# EAGLE design digital (EAGLE 7.4.0)
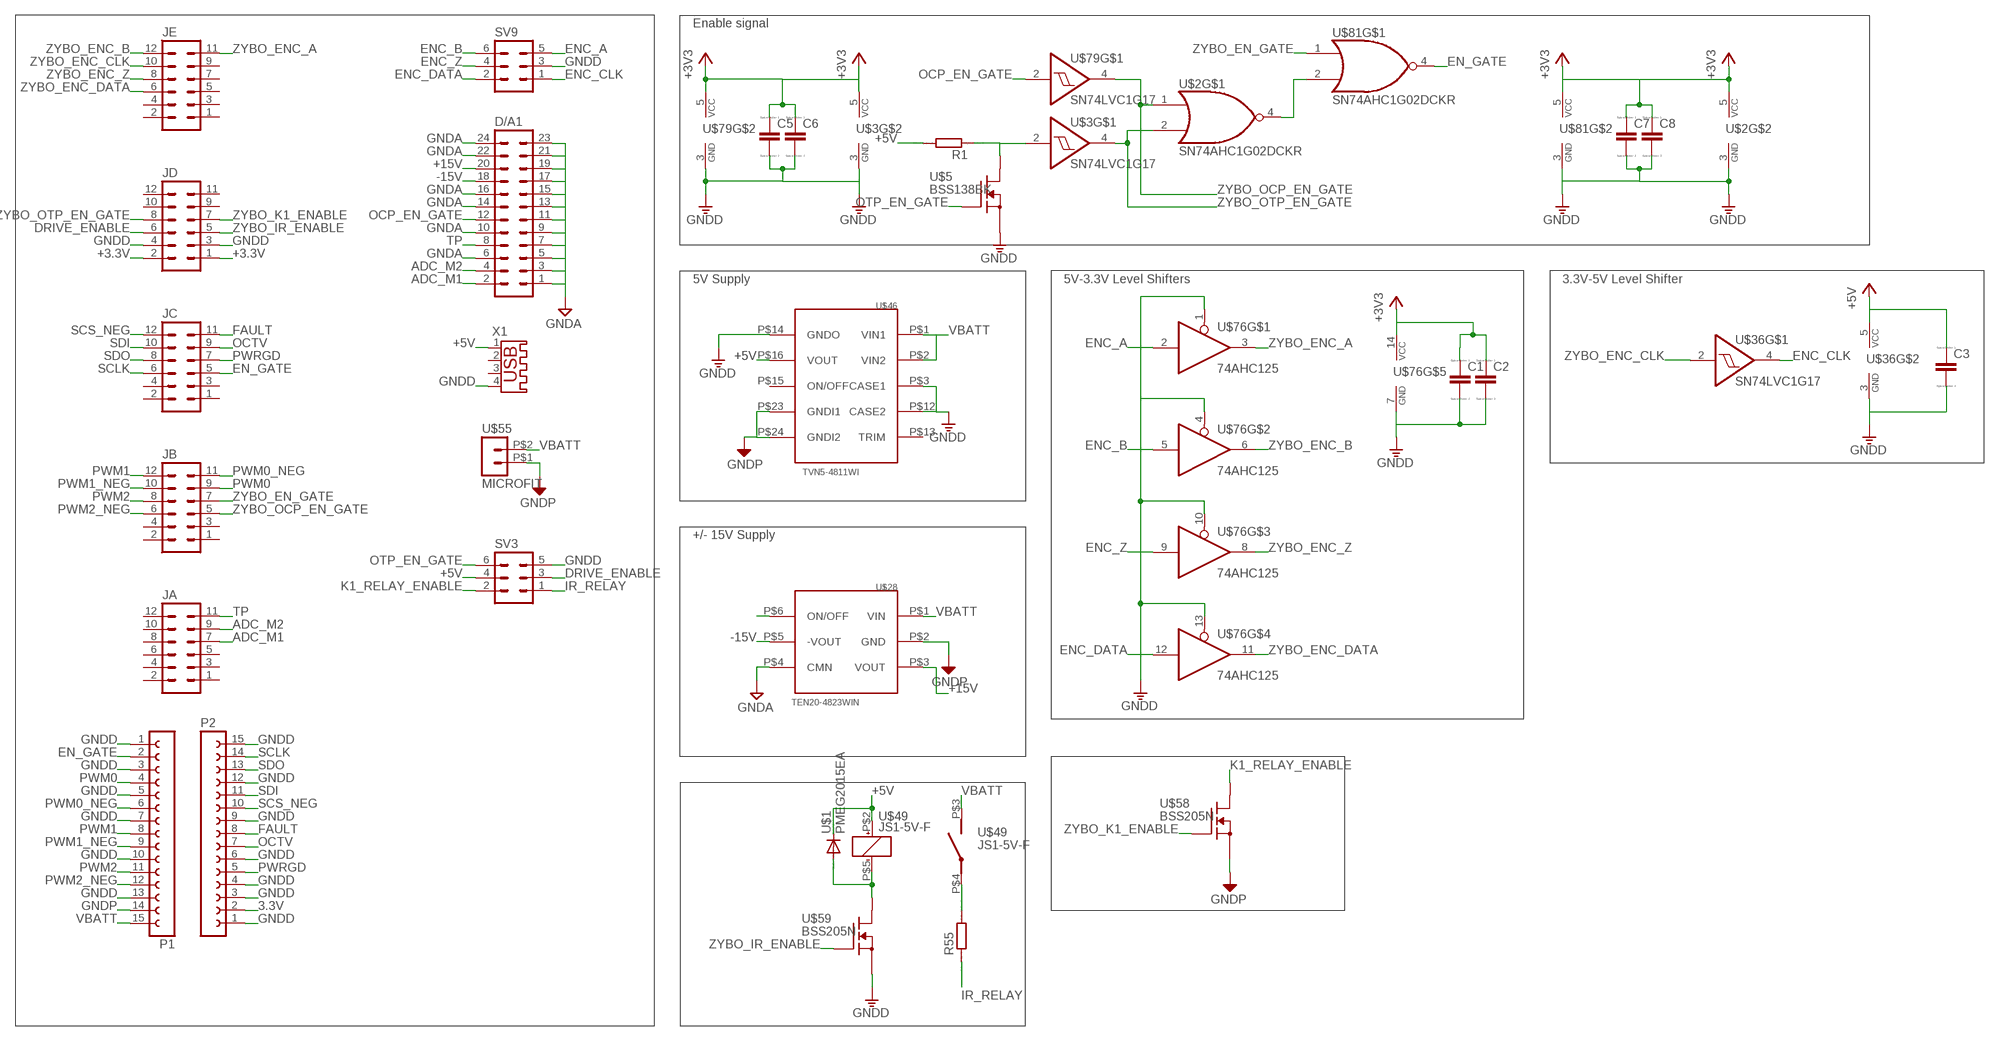
[diagram p0: schematic, sheet 1]

## Parts
C1  CC1206  [C1206]
C2  CC1206  [C1206]
C3  CC1206  [C1206]
C5  CC1206  [C1206]
C6  CC1206  [C1206]
C7  CC1206  [C1206]
C8  CC1206  [C1206]
D/A1  MA12-2  [MA12-2]
JA  MA06-2  [MA06-2]
JB  MA06-2  [MA06-2]
JC  MA06-2  [MA06-2]
JD  MA06-2  [MA06-2]
JE  MA06-2  [MA06-2]
P1  FE15-1  [FE15]
P2  FE15-1  [FE15]
R1  RR1206  [R1206]
R55  RR1206  [R1206]
SV3  MA03-2  [MA03-2]
SV9  MA03-2  [MA03-2]
U$1  PMEG2015EA  [SOD323_ST]
U$2  SN74AHC1G02DCKR  [SOT23-5]
U$3  SN74LVC1G17  [SOT23-5L]
U$5  BSS138BK  [SOT23]
U$28  TEN20-4823WIN  [TEN20-4823]
U$36  SN74LVC1G17  [SOT23-5L]
U$46  TVN5-4811WI  [DIP24]
U$49  JS1-5V-F  [JS1-5V-F]
U$55  MICROFIT  [MICROFIT-3.0]
U$58  BSS205N  [SOT23]
U$59  BSS205N  [SOT23]
U$76  74AHC125  [SO14]
U$79  SN74LVC1G17  [SOT23-5L]
U$81  SN74AHC1G02DCKR  [SOT23-5]
X1  USB-A003  [USB-A003]

## Nets
3.3V: P2.2
+3.3V: JD.1 JD.2
+3V3: C1.1 C2.1 C5.1 C6.1 C7.1 C8.1 U$2.5(VCC) U$3.5(VCC) U$76.14(VCC) U$79.5(VCC) U$81.5(VCC)
+5V: C3.1 R1.2 SV3.4 U$1.C U$36.5(VCC) U$46.P$16(VOUT) U$49.P$2(+) X1.1
+15V: D/A1.20 U$28.P$3(VOUT)
-15V: D/A1.18 U$28.P$5(-VOUT)
ADC_M1: D/A1.2 JA.7
ADC_M2: D/A1.4 JA.9
DRIVE_ENABLE: JD.6 SV3.3
EN_GATE: JC.5 P1.2 U$81.4(O)
ENC_A: SV9.5 U$76.2(I)
ENC_B: SV9.6 U$76.5(I)
ENC_CLK: SV9.1 U$36.4(O)
ENC_DATA: SV9.2 U$76.12(I)
ENC_Z: SV9.4 U$76.9(I)
FAULT: JC.11 P2.8
GNDA: D/A1.1 D/A1.3 D/A1.5 D/A1.6 D/A1.7 D/A1.9 D/A1.10 D/A1.11 D/A1.13 D/A1.14 D/A1.15 D/A1.16 D/A1.22 D/A1.23 D/A1.24 U$28.P$4(CMN)
GNDD: C1.2 C2.2 C3.2 C5.2 C6.2 C7.2 C8.2 JD.3 JD.4 P1.1 P1.3 P1.5 P1.7 P1.10 P1.13 P2.1 P2.3 P2.4 P2.6 P2.9 P2.12 P2.15 SV3.5 SV9.3 U$2.3(GND) U$3.3(GND) U$5.2(S) U$36.3(GND) U$46.P$3(CASE1) U$46.P$12(CASE2) U$46.P$14(GNDO) U$59.2(S) U$76.1(OE) U$76.4(OE) U$76.7(GND) U$76.10(OE) U$76.13(OE) U$79.3(GND) U$81.3(GND) X1.4
GNDP: P1.14 U$28.P$2(GND) U$46.P$23(GNDI1) U$46.P$24(GNDI2) U$55.P$1 U$58.2(S)
IR_RELAY: R55.1 SV3.1
K1_RELAY_ENABLE: SV3.2 U$58.3(D)
N$1: R1.1 U$3.2(I) U$5.3(D)
N$5: U$2.4(O) U$81.2(I1)
N$42: U$28.P$6(ON/OFF)
N$46: R55.2 U$49.P$4(P)
N$66: U$1.A U$49.P$5(-) U$59.3(D)
N$80: D/A1.21
N$81: D/A1.19
N$82: D/A1.17
OCP_EN_GATE: D/A1.12 U$79.2(I)
OCTV: JC.9 P2.7
OTP_EN_GATE: SV3.6 U$5.1(G)
PWM0: JB.9 P1.4
PWM0_NEG: JB.11 P1.6
PWM1: JB.12 P1.8
PWM1_NEG: JB.10 P1.9
PWM2: JB.8 P1.11
PWM2_NEG: JB.6 P1.12
PWRGD: JC.7 P2.5
SCLK: JC.6 P2.14
SCS_NEG: JC.12 P2.10
SDI: JC.10 P2.11
SDO: JC.8 P2.13
TP: D/A1.8 JA.11
VBATT: P1.15 U$28.P$1(VIN) U$46.P$1(VIN1) U$46.P$2(VIN2) U$49.P$3(S) U$55.P$2
ZYBO_EN_GATE: JB.7 U$81.1(I0)
ZYBO_ENC_A: JE.11 U$76.3(O)
ZYBO_ENC_B: JE.12 U$76.6(O)
ZYBO_ENC_CLK: JE.10 U$36.2(I)
ZYBO_ENC_DATA: JE.6 U$76.11(O)
ZYBO_ENC_Z: JE.8 U$76.8(O)
ZYBO_IR_ENABLE: JD.5 U$59.1(G)
ZYBO_K1_ENABLE: JD.7 U$58.1(G)
ZYBO_OCP_EN_GATE: JB.5 U$2.1(I0) U$79.4(O)
ZYBO_OTP_EN_GATE: JD.8 U$2.2(I1) U$3.4(O)
Unconnected: JA.1 JA.2 JA.3 JA.4 JA.5 JA.6 JA.8 JA.10 JA.12 JB.1 JB.2 JB.3 JB.4 JC.1 JC.2 JC.3 JC.4 JD.9 JD.10 JD.11 JD.12 JE.1 JE.2 JE.3 JE.4 JE.5 JE.7 JE.9 U$46.P$13(TRIM) U$46.P$15(ON/OFF) X1.2 X1.3

## Notes on the sheet
- Enable signal
- 5V Supply | 5V-3.3V Level Shifters | 3.3V-5V Level Shifter
- +/- 15V Supply

## Library data of the parts
C1-C3 C5-C8 = eagle-ltspice:C: CAPACITOR, European symbol; SPICEMODEL: NONE; SPICEPREFIX: C
D/A1 = con-lstb:MA12-2: PIN HEADER; OC_FARNELL: unknown; OC_NEWARK: unknown
JA JB JC JD JE = con-lstb:MA06-2: PIN HEADER; OC_FARNELL: unknown; OC_NEWARK: unknown
P1 P2 = con-lsta:FE15-1: FEMALE HEADER; OC_FARNELL: unknown; OC_NEWARK: unknown
R1 R55 = eagle-ltspice:R: RESISTOR, European symbol; SPICEMODEL: NONE; SPICEPREFIX: R
SV3 SV9 = con-lstb:MA03-2: PIN HEADER; OC_FARNELL: unknown; OC_NEWARK: unknown
U$1 = custom_parts:PMEG2015EA
U$2 U$81 = custom_parts:SN74AHC1G02DCKR
U$3 U$36 U$79 = custom_parts:SN74LVC1G17
U$5 = custom_parts:BSS138BK
U$28 = custom_parts:TEN20-4823WIN
U$46 = custom_parts:TVN5-4811WI
U$49 = custom_parts:JS1-5V-F
U$55 = custom_parts:MICROFIT
U$58 U$59 = custom_parts:BSS205N
U$76 = custom_parts:74AHC125
X1 = con-yamaichi:USB-A003: USB connector; OC_FARNELL: unknown; OC_NEWARK: unknown

## Board
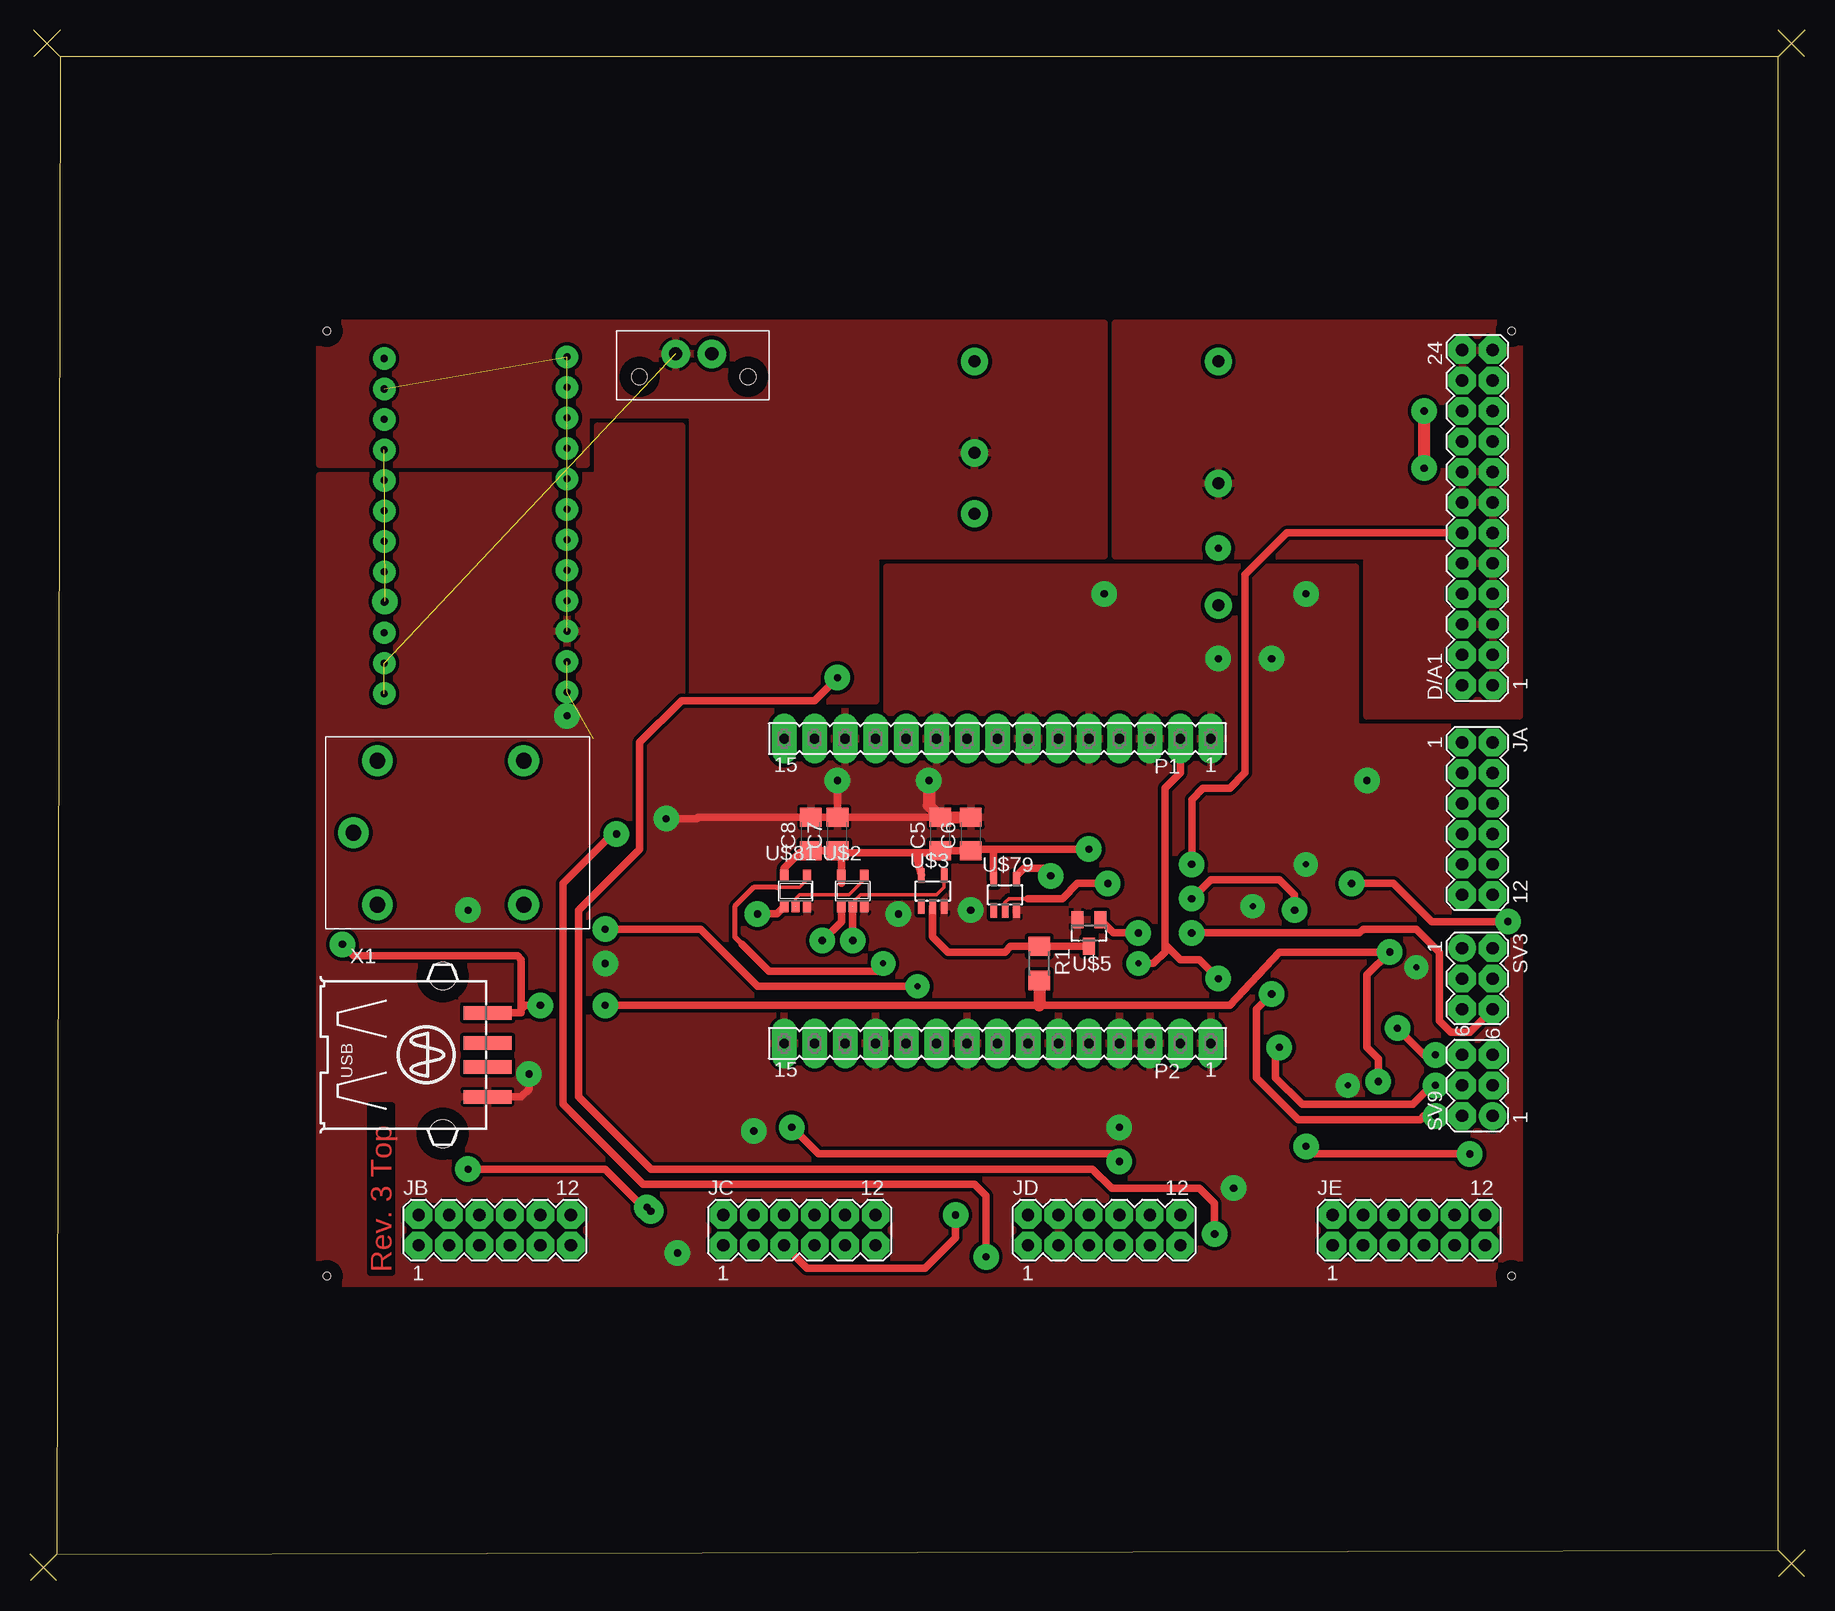
[diagram p1: board, top side]
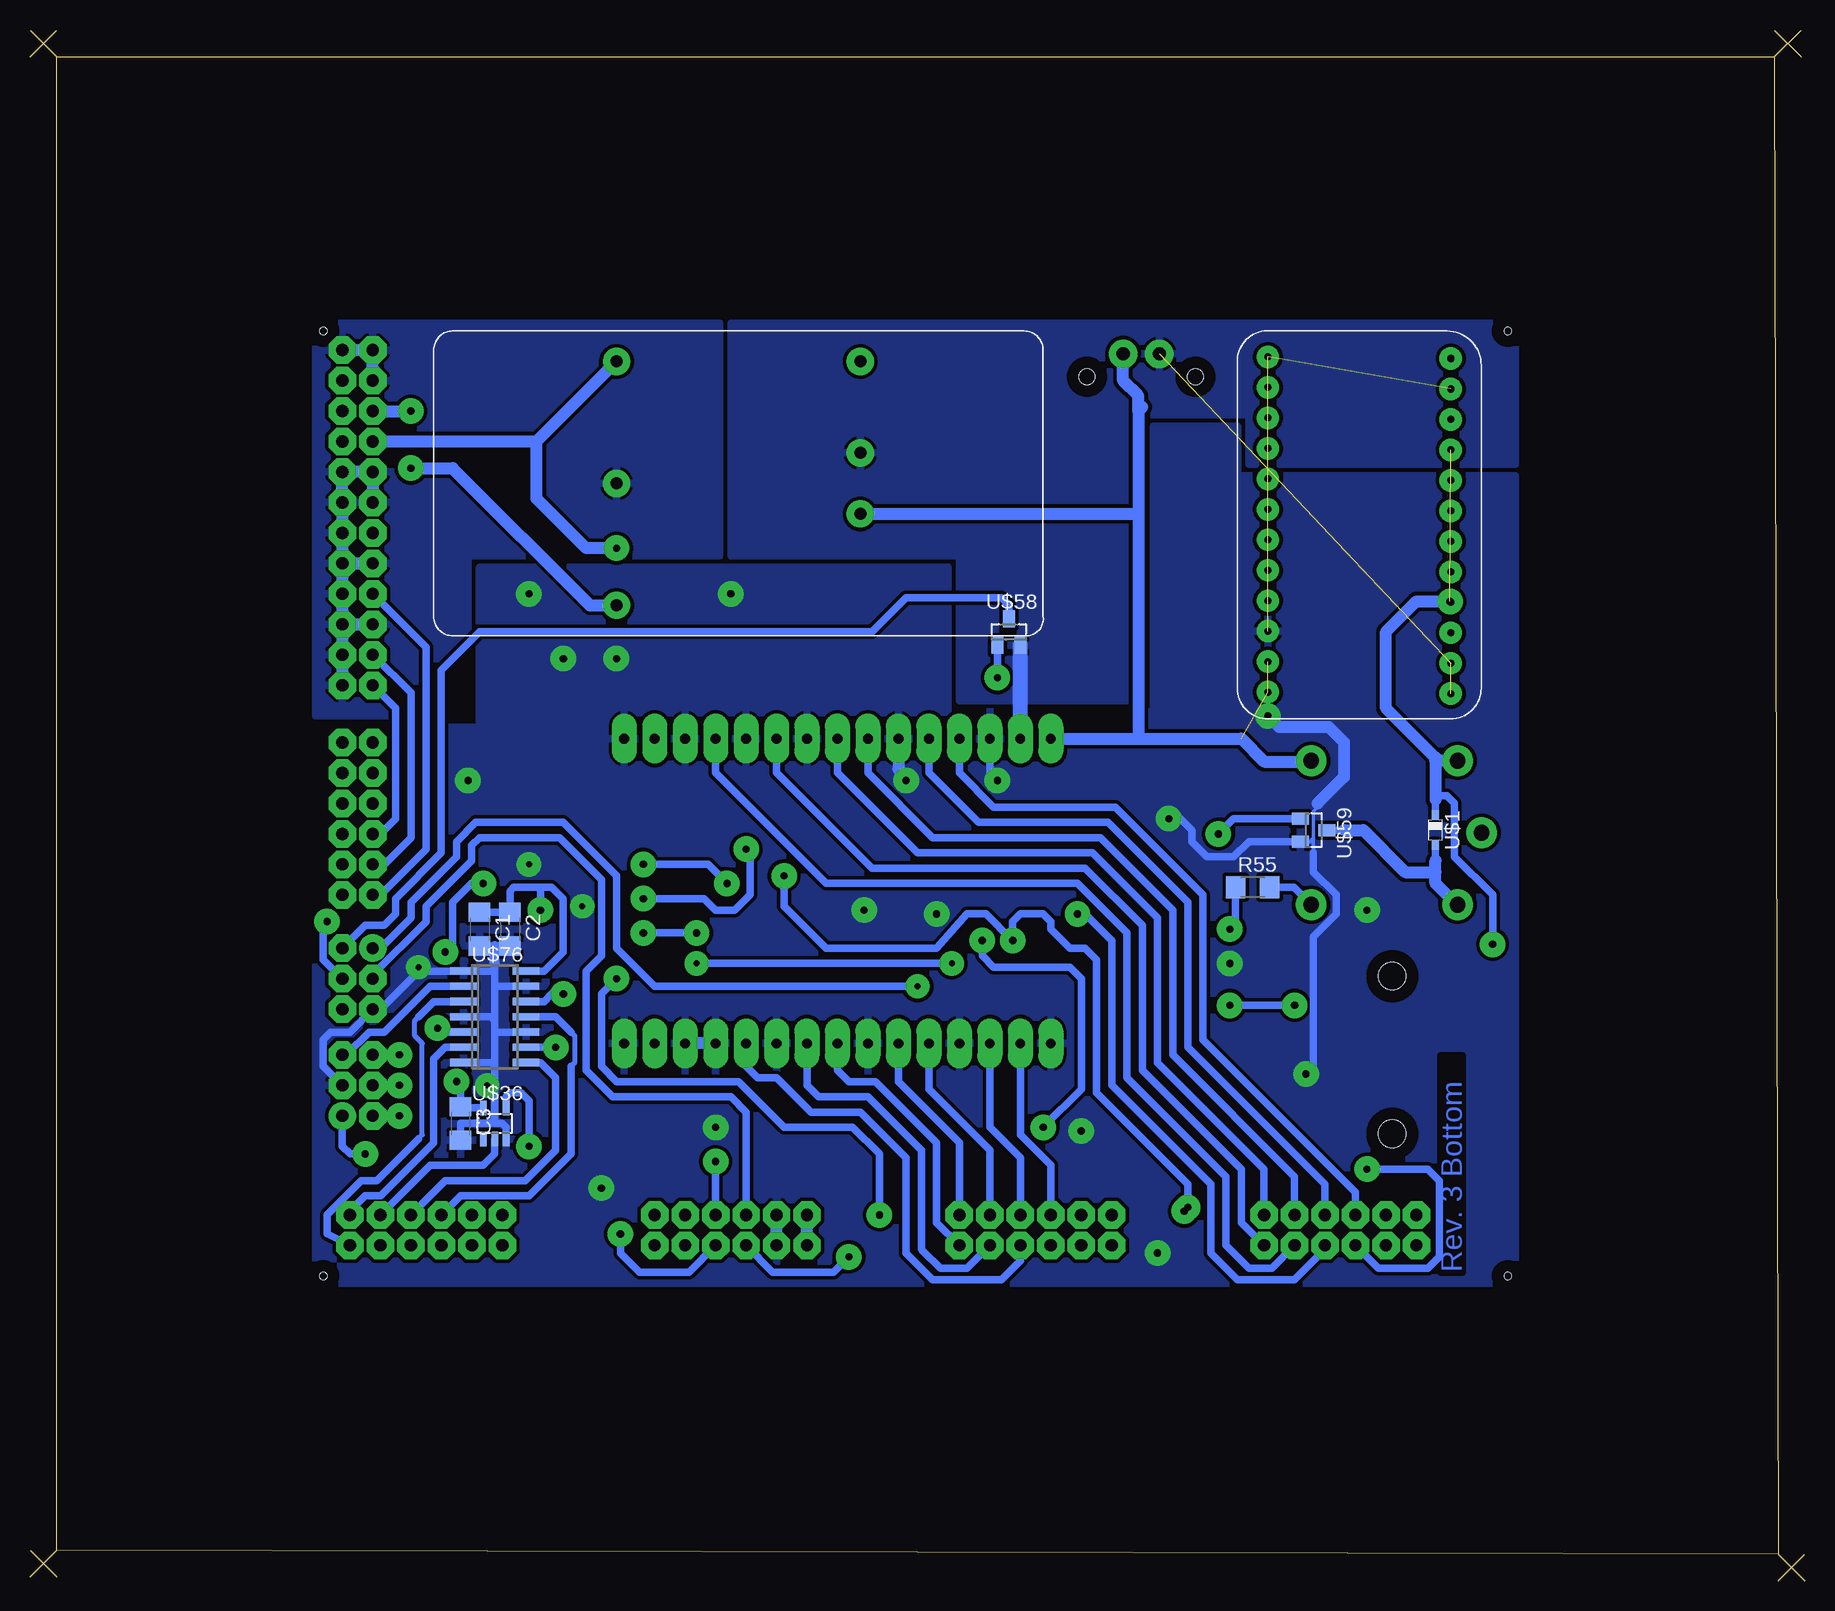
[diagram p2: board, bottom side, seen from below]

Size 147.96 x 129.22 mm. Coordinates in mm from the lower left corner, seen from the top.
Outline: 2.22,2.22 145.72,2.54 145.72,126.99 2.54,126.99 2.22,2.22
Outline: 2.54,127 0.32,129.22
Outline: 2.54,129.22 0.32,127
Outline: 147.96,0.32 145.73,2.54
Outline: 147.96,127 145.73,129.22
Outline: 2.22,0 0,2.22
Outline: 147.96,129.22 145.73,127
Outline: 147.96,2.54 145.73,0.32
Outline: 2.22,2.22 0,0
Copper layers (1*16): Top 0.035mm / dielectric 1.5mm / Bottom 0.035mm
Design rules "default *": minimum track width 10mil, minimum drill 24mil, track to track 12mil, track to pad 12mil, pad to pad 12mil, via to via 8mil, smd to smd 8mil, copper to edge 40mil, drill to drill 8mil, minimum pad ring 25mil, minimum via ring 30mil, stop-mask expansion 4mil, vias tented up to drill 0mil, thermal gap 10mil
Holes 0.6 mm at 24.77,25.4 24.77,104.14 123.51,25.4 123.51,104.14

### Footprints (pad centres in the part's own frame; a part is rotated, then mirrored left to right if it is on the bottom)
C1206 = smd 1.6 x 1.8: 1 -1.4,0; 2 1.4,0
MA12-2 = drill 1.016 octagon: 1 -13.97,-1.27; 2 -13.97,1.27; 3 -11.43,-1.27; 4 -11.43,1.27; 5 -8.89,-1.27; 6 -8.89,1.27; 7 -6.35,-1.27; 8 -6.35,1.27; 9 -3.81,-1.27; 10 -3.81,1.27; 11 -1.27,-1.27; 12 -1.27,1.27; 13 1.27,-1.27; 14 1.27,1.27; 15 3.81,-1.27; 16 3.81,1.27; 17 6.35,-1.27; 18 6.35,1.27; 19 8.89,-1.27; 20 8.89,1.27; 21 11.43,-1.27; 22 11.43,1.27; 23 13.97,-1.27; 24 13.97,1.27
MA06-2 = drill 1.016 octagon: 1 -6.35,-1.27; 2 -6.35,1.27; 3 -3.81,-1.27; 4 -3.81,1.27; 5 -1.27,-1.27; 6 -1.27,1.27; 7 1.27,-1.27; 8 1.27,1.27; 9 3.81,-1.27; 10 3.81,1.27; 11 6.35,-1.27; 12 6.35,1.27
FE15 = drill 0.813 long: 1 -17.78,0; 2 -15.24,0; 3 -12.7,0; 4 -10.16,0; 5 -7.62,0; 6 -5.08,0; 7 -2.54,0; 8 0,0; 9 2.54,0; 10 5.08,0; 11 7.62,0; 12 10.16,0; 13 12.7,0; 14 15.24,0; 15 17.78,0
R1206 = smd 1.6 x 1.803: 1 -1.422,0; 2 1.422,0
MA03-2 = drill 1.016: 1 -2.54,-1.27 | drill 1.016 octagon: 2 -2.54,1.27; 3 0,-1.27; 4 0,1.27; 5 2.54,-1.27; 6 2.54,1.27
SOD323_ST = smd 0.8 x 0.6: A 1.25,0; C -1.25,0
SOT23-5 = smd 0.69 x 0.99: 1 -0.95,-1.29; 2 0,-1.29; 3 0.95,-1.29; 4 0.95,1.3; 5 -0.95,1.3
SOT23-5L = smd 0.55 x 1.2: 1 -0.95,-1.3; 2 0,-1.3; 3 0.95,-1.3; 4 0.95,1.3; 5 -0.95,1.3
SOT23 = smd 1 x 1.4: 1 -0.95,-1.1; 2 0.95,-1.1; 3 0,1.1
TEN20-4823 = drill 1 pad 2.184: P$1 15.24,-10.16; P$2 15.24,-15.24; P$3 35.56,-2.54; P$4 35.56,-12.7; P$5 35.56,-22.86; P$6 15.24,-22.86
DIP24 = drill 0.6 pad 1.676: P$1 7.62,19.622; P$2 7.62,17.081; P$3 7.62,14.541; P$4 7.62,12.002; P$5 7.62,9.461; P$6 7.62,6.921; P$7 7.62,4.381; P$8 7.62,1.841; P$9 7.62,-0.699; P$10 7.62,-3.239; P$11 7.62,-5.779; P$12 7.62,-8.319; P$13 -7.62,-8.191; P$14 -7.62,-5.652; P$15 -7.62,-3.111; P$16 -7.62,-0.572; P$17 -7.62,1.968; P$18 -7.62,4.508; P$19 -7.62,7.048; P$20 -7.62,9.588; P$21 -7.62,12.129; P$22 -7.62,14.668; P$23 -7.62,17.209; P$24 -7.62,19.748
JS1-5V-F = drill 1.3 pad 2.54: P$1 -8.6,0.1; P$2 -6.6,6.1; P$3 5.6,6.1; P$4 5.6,-5.9; P$5 -6.6,-5.9
MICROFIT-3.0 = drill 1.1 pad 1.93: P$1 0.476,0.635; P$2 3.493,0.635 | hole 1.3: -2.54,-1.27; 6.509,-1.27
SO14 = smd 0.6 x 2.2: 1 -3.81,-2.6; 2 -2.54,-2.6; 3 -1.27,-2.6; 4 0,-2.6; 5 1.27,-2.6; 6 2.54,-2.6; 7 3.81,-2.6; 8 3.81,2.6; 9 2.54,2.6; 10 1.27,2.6; 11 0,2.6; 12 -1.27,2.6; 13 -2.54,2.6; 14 -3.81,2.6
USB-A003 = smd 1.12 x 4: 1 -3.5,14; 2 -1,14; 3 1,14; 4 3.5,14 | hole 2.3: -6.57,10.28; 6.57,10.28

### Placement (x,y rotation side)
C1  110.49,54.29 270 bottom
C2  107.95,54.29 270 bottom
C3  112.08,38.1 270 bottom
C5  75.88,62.23 90 top
C6  78.42,62.23 90 top
C7  67.31,62.23 90 top
C8  65.09,62.23 90 top
D/A1  120.65,88.58 90 top
JA  120.65,63.5 270 top
JB  38.73,29.21 0 top
JC  64.14,29.21 0 top
JD  89.53,29.21 0 top
JE  114.94,29.21 0 top
P1  80.64,70.17 180 top
P2  80.64,44.77 180 top
R1  84.14,51.44 270 top
R55  46.04,57.79 0 bottom
SV3  120.65,50.16 270 top
SV9  120.65,41.28 90 top
U$1  30.8,62.55 270 bottom
U$2  68.58,57.47 0 top
U$3  75.25,57.47 0 top
U$5  88.27,53.98 180 top
U$28  63.5,78.74 180 bottom
U$36  109.22,38.1 0 bottom
U$46  37.15,93.66 180 bottom
U$49  35.56,62.23 0 top
U$55  53.34,101.6 0 top
U$58  66.36,79.06 0 bottom
U$59  40.96,62.55 270 bottom
U$76  109.22,46.99 270 bottom
U$79  81.28,57.15 0 top
U$81  63.82,57.47 0 top
X1  24.13,43.81 270 top

### Tracks (layer width: path | path; a pad name or v marks a point on that pad's centre or on a via)
+3.3V
  Bottom 1.016: JD.1 JD.2
+3V3  (via drill 0.6)
  Top 0.61: U$81.5 62.87,59.38 64.14,60.64 64.9,60.64 C8.1 C7.1 | U$2.5 67.63,58.13 67.63,60.51 C7.1 | 73.98,60.01 U$3.5 73.98,60.01 | C6.1 C5.1 75.69,60.64 73.98,60.64 | C6.1 78.42,60.33 79.06,60.96 80.33,60.96 | 73.98,60.64 67.5,60.64 C7.1 | 73.98,60.01 73.98,60.64 | 78.61,60.64 C6.1 | v88.27,60.96 80.33,60.96 | v105.41,55.88 105.41,57.15 104.14,58.42 98.42,58.42 v96.84,56.83 | U$79.5 80.33,60.96
  Bottom 0.61: C1.1 C2.1 107.95,57.47 107.63,57.79 105.41,57.79 | U$76.14 105.09,50.8 103.5,52.39 103.5,56.83 104.46,57.79 105.41,57.79 | v88.27,60.96 87.95,60.64 87.95,57.15 89.22,55.88 90.8,55.88 91.76,56.83 v96.84,56.83 | v105.41,55.88 105.41,57.79
+5V  (via drill 0.6)  (1 unrouted)
  Top 0.61: 40.96,47.31 39.37,47.31 X1.1 | 40.95,47.31 40.96,47.31 | 40.96,47.31 40.96,47.62 | 40.96,47.62 40.96,51.75 40.64,52.07 26.99,52.07 v26.04,53.02 | v112.39,41.59 112.39,43.5 111.44,44.45 111.44,50.48 v113.35,52.39 104.14,52.39 100.01,47.94 84.14,47.94 v47.94,47.94 | v123.19,54.93 116.84,54.93 113.66,58.1 v110.17,58.1 | v42.55,47.94 41.27,47.94 40.96,47.62
  Top 1.016: R1.2 84.14,47.94 | X1.1 39.36,47.31 39.37,47.31
  Bottom 0.61: v123.19,54.93 123.51,54.29 123.51,51.75 SV3.4 | v26.04,53.02 26.04,57.15 29.21,60.33 29.21,64.77 29.84,65.41 30.8,65.41 | 30.8,65.09 U$1.C | U$49.P$2 29.78,68.33 | U$36.5 111.98,39.4 C3.1 112.08,41.28 v112.39,41.59 | v113.35,52.39 112.71,53.02 112.71,56.52 111.12,58.1 v110.17,58.1 | v47.94,47.94 v42.55,47.94
  Bottom 1.016: 30.8,68.26 30.8,65.41 30.8,65.09 | U$49.P$2 30.73,68.33 30.8,68.26 | v29.59,81.6 32.38,81.6 34.92,79.06 34.92,72.71 30.8,68.58 30.8,68.26
+15V  (via drill 0.6)
  Top 1.016: v116.2,97.47 v116.2,92.71
  Bottom 1.016: D/A1.20 v116.2,97.47 | U$28.P$3 101.28,81.28 112.71,92.71 v116.2,92.71
-15V  (via drill 0.6)
  Bottom 1.016: D/A1.18 105.73,94.93 | 105.73,94.93 U$28.P$5 | v99.06,86.04 101.6,86.04 105.73,90.17 105.73,94.93
ADC_M1
  Bottom 0.61: D/A1.2 117.47,72.71 117.47,63.5 118.74,62.23 JA.7
ADC_M2
  Bottom 0.61: JA.9 119.06,59.05 116.2,61.91 116.2,73.98 D/A1.4
DRIVE_ENABLE
  Bottom 0.61: SV3.3 119.38,50.48 114.94,54.93 114.94,56.2 111.12,60.01 111.12,61.28 110.49,61.91 103.82,61.91 100.33,58.42 100.33,52.07 101.6,50.8 101.6,42.55 99.38,40.32 89.53,40.32 88.27,39.05 JD.6
EN_GATE  (via drill 0.5, 0.6)
  Top 0.305: U$81.4 64.77,58.42 64.14,57.79 62.23,57.79
  Top 0.406: 59.37,53.02 58.74,53.66 58.74,56.2 59.05,56.52 59.37,56.83 60.33,57.79 62.23,57.79
  Top 0.61: JC.5 64.77,26.04 74.61,26.04 77.15,28.57 v77.15,30.48 | v99.06,50.16 97.47,51.75 95.88,51.75 94.61,53.02 | 94.61,53.02 94.61,66.04 95.88,67.31 P1.2 | 94.61,53.02 94.61,52.39 93.66,51.44 v92.39,51.44 | 59.37,53.02 61.59,50.8 70.8,50.8 v71.12,51.44
  Bottom 0.61: v99.06,50.16 100.33,48.89 100.33,42.86 99.06,41.59 88.9,41.59 85.09,37.78 79.38,37.78 77.15,35.56 v77.15,30.48 | v92.39,51.44 v71.12,51.44
ENC_A
  Bottom 0.61: SV9.5 121.6,43.81 119.7,45.72 118.43,45.72 114.62,49.53 U$76.2
ENC_B  (via drill 0.6)
  Top 0.61: v117.16,43.81 116.2,43.81 v113.98,46.04
  Bottom 0.61: SV9.6 v117.16,43.81 | v113.98,46.04 113.35,46.04 113.03,45.72 U$76.5
ENC_CLK  (via drill 0.6)
  Top 0.61: v120.02,35.56 107,35.56 v106.36,36.2
  Bottom 0.61: SV9.1 121.92,36.2 121.28,35.56 v120.02,35.56 | v106.36,36.2 106.36,40.01 107,40.64 107.95,40.64 108.27,40.32 U$36.4
ENC_DATA  (via drill 0.6)
  Top 0.61: v117.16,38.73 116.2,38.73 115.89,38.42 105.73,38.42 102.23,41.91 102.23,47.62 v103.5,48.89
  Bottom 0.61: SV9.2 118.11,38.73 117.47,39.37 v117.16,38.73 | v103.5,48.89 104.46,48.89 105.09,48.26 U$76.12
ENC_Z  (via drill 0.6)
  Top 0.61: v104.14,44.45 103.82,43.81 103.82,41.91 106.05,39.69 115.25,39.69 116.84,41.28 v117.16,41.28
  Bottom 0.61: U$76.9 v104.14,44.45 | v117.16,41.28 SV9.4
FAULT
  Bottom 0.61: P2.8 80.64,42.55 79.69,41.59 77.47,41.59 72.39,36.51 72.39,29.84 JC.11
GNDA
  Bottom 1.016: D/A1.15 D/A1.16 D/A1.14 | 121.92,91.76 D/A1.13 D/A1.9 | D/A1.5 D/A1.7 D/A1.9 | D/A1.1 D/A1.3 D/A1.5 | D/A1.9 D/A1.10 | D/A1.5 D/A1.6 | D/A1.22 D/A1.24 D/A1.23
  pour Bottom: 90.49,104.78 124.14,104.78 124.14,72.07 111.44,72.07 111.44,85.41 90.49,85.41
  pour Top: 90.49,85.41 90.49,104.78 124.14,104.78 124.14,72.07 111.44,72.07 111.44,85.41
GNDD  (via drill 0.5, 0.6)  (2 unrouted)
  Top 0.61: C7.2 C8.2 55.69,63.63 55.56,63.5 v53.02,63.5 | v67.31,66.67 C7.2 | C5.2 C7.2 | v41.59,42.23 41.59,40.96 40.96,40.32 X1.4
  Top 1.016: v74.93,66.67 74.93,64.58 C5.2 C6.2
  Bottom 0.305: 40.64,64.77 40.64,64.45 40.96,64.13 40.96,61.91 | 40.96,61.91 41.27,61.59 | 41.27,61.59 U$59.2 | 41.27,61.59 40.96,61.59 | 40.96,61.59 40.96,61.91 | 40.96,61.59 40.96,60.64
  Bottom 0.61: 109.22,50.8 U$76.1 115.57,50.8 118.74,47.62 SV3.5 121.28,45.72 122.87,45.72 123.51,45.09 123.51,42.86 SV9.3 | 109.22,49.53 109.22,46.67 | 109.22,46.67 109.22,45.72 | 109.22,45.72 109.22,43.18 | 109.22,43.18 U$76.7 | 109.22,50.8 109.22,49.53 | 109.22,49.53 U$76.13 | U$76.10 109.22,45.72 | U$76.4 109.54,46.99 109.22,46.67 | 109.22,43.18 109.22,38.42 | 109.22,38.42 109.22,38.1 108.58,38.1 108.27,37.78 U$36.3 | C2.2 109.22,52.89 C1.2 | 109.22,50.8 109.22,51.44 | P1.13 67.94,67.31 v67.31,66.67 | U$59.2 46.36,61.59 47.62,60.33 49.85,60.33 51.12,61.59 51.12,62.55 52.07,63.5 v53.02,63.5 | C3.2 112.08,38.1 109.54,38.1 109.22,38.42 | 40.96,60.64 40.96,59.05 39.05,57.15 39.05,55.56 40.96,53.66 40.96,42.86 v41.59,42.23
  Bottom 0.813: 109.22,51.44 109.22,52.89
  Bottom 1.016: JD.3 JD.4 | P1.10 75.56,67.63 v74.93,66.67 | 40.64,64.77 38.42,66.99 38.42,69.85 39.69,71.12 43.81,71.12 v44.77,72.07 | P2.4 P2.3
  other vias: 99.06,76.84 103.5,76.84 111.44,66.67 36.51,55.88 47.94,51.44 100.33,32.7 53.97,27.3 60.33,37.47 90.8,37.78 109.85,41.28 106.36,59.69 115.57,51.12 101.92,56.2 89.53,82.23 106.36,82.23 72.39,55.56 78.42,55.88
  pour Top: 24.13,92.08 47.31,92.08 47.31,96.2 54.29,96.2 54.29,72.39 71.44,72.39 71.44,84.45 110.49,84.45 110.49,71.12 124.14,71.12 124.14,24.77 24.13,24.77
  pour Bottom: 24.13,92.08 47.31,92.08 47.31,96.2 54.29,96.2 54.29,72.39 71.44,72.39 71.44,84.45 110.49,84.45 110.49,71.12 124.14,71.12 124.14,24.77 24.13,24.77
GNDP  (2 unrouted)
  Bottom 1.016: P1.14
  Bottom 1.27: P1.14 U$58.2
  pour Bottom: 89.53,104.78 89.53,85.41 70.48,85.41 70.48,73.34 55.24,73.34 55.24,97.16 46.36,97.16 46.36,93.03 24.13,93.03 24.13,104.78
  pour Top: 24.13,104.78 89.53,104.78 89.53,85.41 70.48,85.41 70.48,73.34 55.24,73.34 55.24,97.16 46.36,97.16 46.36,93.03 24.13,93.03
IR_RELAY  (via drill 0.5, 0.6)
  Top 0.61: v47.94,54.29 55.88,54.29 60.64,49.53 v73.98,49.53
  Bottom 0.61: SV3.1 118.74,52.7 116.2,55.25 116.2,56.52 112.39,60.33 112.39,61.59 110.81,63.18 103.5,63.18 99.06,58.74 99.06,52.7 95.88,49.53 v73.98,49.53 | R55.1 47.46,54.78 v47.94,54.29
K1_RELAY_ENABLE
  Bottom 0.61: SV3.2 120.02,54.61 118.43,54.61 117.47,55.56 117.47,56.83 113.66,60.64 113.66,75.88 110.49,79.06 77.79,79.06 74.93,81.91 66.99,81.91 66.36,81.28 U$58.3
N$1
  Top 0.61: U$5.3 88.25,52.86 R1.1 81.75,52.86 81.28,52.39 76.52,52.39 75.25,53.66 U$3.2
N$5
  Top 0.305: U$2.4 69.53,58.42 68.26,57.15 64.14,57.15 63.82,56.83 U$81.2
  Top 0.406: 63.82,56.2 U$81.2
N$46
  Bottom 0.61: R55.2 42.61,57.79 U$49.P$4
N$66
  Bottom 0.61: 30.8,60.01 U$1.A | U$59.3 38.42,62.55
  Bottom 1.016: U$49.P$5 29.02,56.33 30.8,58.1 30.8,59.05 | 30.8,59.05 30.8,60.01 | 38.42,62.55 36.83,62.55 33.34,59.05 30.8,59.05
OCP_EN_GATE  (via drill 0.6)
  Top 0.305: 83.19,56.83 81.6,56.83 81.28,56.52 U$79.2
  Top 0.61: D/A1.12 104.77,87.31 101.28,83.82 101.28,67.31 100.01,66.04 97.79,66.04 96.84,65.09 v96.84,59.69 | v89.85,58.1 87.31,58.1 86.04,56.83 83.19,56.83
  Bottom 0.61: v96.84,59.69 91.44,59.69 v89.85,58.1
OCTV
  Bottom 0.61: P2.7 83.19,41.28 82.23,40.32 78.11,40.32 73.66,35.88 73.66,27.62 73.5,27.46 72.07,26.04 69.85,26.04 JC.9
OTP_EN_GATE  (via drill 0.6)
  Top 0.61: SV3.6 120.02,45.72 118.43,45.72 117.47,46.67 117.47,52.39 115.57,54.29 111.12,54.29 110.81,53.98 v96.84,53.98 | v92.39,53.98 90.31,53.98 U$5.1
  Bottom 0.61: v96.84,53.98 v92.39,53.98
PWM0
  Bottom 0.61: JB.9 44.45,26.04 46.36,26.04 48.26,27.94 48.26,33.66 56.52,41.91 56.52,53.98 60.64,58.1 81.6,58.1 90.8,67.31 P1.4
PWM0_NEG
  Bottom 0.61: JB.11 46.99,29.84 46.99,34.29 55.24,42.55 55.24,54.61 60.01,59.37 77.79,59.37 85.72,67.31 P1.6
PWM1
  Bottom 0.61: P1.8 80.64,67.31 73.98,60.64 59.37,60.64 53.97,55.25 53.97,43.18 45.08,34.29 JB.12
PWM1_NEG
  Bottom 0.61: P1.9 78.11,67.31 72.71,61.91 58.74,61.91 52.7,55.88 52.7,43.81 42.55,33.66 JB.10
PWM2
  Bottom 0.61: 40,31.12 JB.8 40,33.02 51.44,44.45 51.44,56.52 58.1,63.18 68.9,63.18 73.03,67.31 P1.11
PWM2_NEG
  Bottom 0.61: P1.12 70.48,67.31 67.63,64.45 57.47,64.45 50.16,57.15 50.16,45.09 37.47,32.38 JB.6
PWRGD
  Bottom 0.61: P2.5 88.27,42.86 87.31,41.91 85.72,41.91 82.87,39.05 78.74,39.05 74.93,35.24 74.93,27.3 72.71,25.08 66.99,25.08 65.41,26.67 JC.7
SCLK
  Bottom 0.61: JC.6 62.86,34.61 65.41,37.15 P2.14
SCS_NEG
  Bottom 0.61: JC.12 70.48,36.51 75.56,41.59 P2.10
SDI
  Bottom 0.61: P2.11 73.03,40.96 67.94,35.88 JC.10
SDO
  Bottom 0.61: JC.8 65.41,35.24 67.94,37.78 P2.13
TP
  Bottom 0.61: D/A1.8 114.94,77.79 114.94,60.96 118.74,57.15 JA.11
VBATT  (2 unrouted)
  Bottom 1.016: P1.15 55.56,70.17 | 55.56,70.17 46.99,70.17 45.08,68.26 41.23,68.26 U$49.P$3 | 55.24,97.79 55.56,97.47 | 55.56,97.47 55.56,98.74 56.83,100.01 U$55.P$2 | 55.56,97.47 55.56,88.9 | 55.56,88.9 55.56,70.17 | U$28.P$1 55.56,88.9
ZYBO_EN_GATE  (via drill 0.6)
  Top 0.61: v60.64,55.56 62.25,55.56 U$81.1
  Bottom 0.61: JB.7 40,27.62 42.55,25.08 47.31,25.08 49.53,27.3 49.53,33.02 57.78,41.28 57.78,53.34 60.01,55.56 v60.64,55.56
ZYBO_ENC_A
  Bottom 0.406: 115.57,36.83 115.25,37.15 115.25,44.77 115.89,45.4 115.89,46.67 115.57,46.99
  Bottom 0.61: JE.11 123.19,28.89 123.19,30.48 120.33,33.34 119.06,33.34 115.57,36.83 | 115.57,46.99 114.3,48.26 U$76.3
ZYBO_ENC_B
  Bottom 0.61: U$76.6 113.35,44.45 114.3,43.5 114.3,36.51 118.74,32.07 120.02,32.07 121.28,30.8 JE.12
ZYBO_ENC_CLK
  Bottom 0.61: U$36.2 109.22,35.56 110.17,34.61 114.62,34.61 JE.10
ZYBO_ENC_DATA
  Bottom 0.406: 102.87,45.72 102.55,45.4 102.55,43.18 102.87,42.86
  Bottom 0.61: JE.6 112.08,32.07 106.36,32.07 102.87,35.56 102.87,42.86 | U$76.11 104.14,46.99 102.87,45.72
ZYBO_ENC_Z
  Bottom 0.61: U$76.8 105.41,43.18 104.14,41.91 104.14,35.88 106.68,33.34 113.35,33.34 JE.8
ZYBO_IR_ENABLE  (via drill 0.6)
  Top 0.61: v79.69,26.99 79.69,32.07 78.74,33.02 51.12,33.02 44.45,39.69 44.45,58.1 48.58,62.23 v48.89,62.23
  Bottom 0.61: U$59.1 47.63,63.5 v48.89,62.23 | JD.5 86.04,25.72 80.96,25.72 v79.69,26.99
ZYBO_K1_ENABLE  (via drill 0.6)
  Top 0.61: v67.31,75.25 65.41,73.34 54.29,73.34 50.8,69.85 50.8,60.96 45.72,55.88 45.72,40.32 51.75,34.29 88.58,34.29 90.17,32.7 97.47,32.7 98.74,31.43 v98.74,28.89
  Bottom 0.61: v67.31,75.25 U$58.1 | JD.7 93.03,25.72 97.16,25.72 98.74,27.3 v98.74,28.89
ZYBO_OCP_EN_GATE  (via drill 0.6)
  Top 0.61: U$2.1 67.63,55.54 67.63,54.93 v66.04,53.34 | U$79.4 82.23,58.73 82.87,59.37 84.45,59.37 v85.09,58.74 | v36.51,34.29 47.94,34.29 51.12,31.12 v51.44,31.12 v51.75,30.8
  Bottom 0.61: v85.09,58.74 85.09,56.2 81.6,52.7 72.39,52.7 69.85,55.56 68.26,55.56 v66.04,53.34 66.04,54.93 65.41,55.56 63.5,55.56 62.86,54.93 62.86,54.29 61.28,52.7 60.01,52.7 59.05,51.75 59.05,40.64 51.44,33.02 v51.44,31.12 | JB.5 35.56,26.04 31.43,26.04 30.48,26.99 30.48,33.34 31.43,34.29 v36.51,34.29
ZYBO_OTP_EN_GATE  (via drill 0.6)
  Top 0.305: U$2.2 68.58,56.52 69.22,57.15 75.56,57.15 76.2,57.79 U$3.4
  Top 0.406: 68.58,55.56 U$2.2
  Top 0.61: 68.58,55.56 v68.58,53.34 | v63.5,37.78 65.72,35.56 90.17,35.56 v90.8,34.92
  Bottom 0.61: v63.5,37.78 60.33,40.96 60.33,50.16 61.28,51.12 67.63,51.12 68.58,52.07 v68.58,53.34 | v90.8,34.92 JD.8

### Text on the board
Top: Rev. 3 Top
Bottom: Rev. 3 Bottom